# Altium schematic sheet Main_ASCII.SchDoc
size 152 x 127 mm; SheetNumber: 1
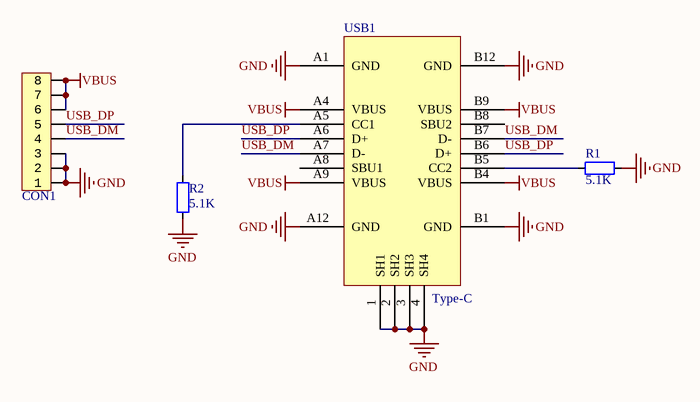
[diagram p0: Main_ASCII.SchDoc]

## Parts
CON1  FFC_0.5_8  [FFC_0.5_8]  (value not drawn)
R1  5.1K  [RES_0402]
R2  5.1K  [RES_0402]
USB1  Type-C  [Type-C-TOP]

## Nets
GND: CON1.1 CON1.2 CON1.3 R1.1 R2.2 USB1.1(SH1) USB1.2(SH2) USB1.3(SH3) USB1.4(SH4) USB1.A1(GND) USB1.A12(GND) USB1.B1(GND) USB1.B12(GND)
VBUS: CON1.6 CON1.7 CON1.8 USB1.A4(VBUS) USB1.A9(VBUS) USB1.B4(VBUS) USB1.B9(VBUS)
USB_DM: CON1.4 USB1.A7(D-) USB1.B7(D-)
USB_DP: CON1.5 USB1.A6(D+) USB1.B6(D+)
NetR1_2: R1.2 USB1.B5(CC2)
NetR2_1: R2.1 USB1.A5(CC1)

Not connected (* = marked no-connect by the designer): USB1 A8(SBU1) B8(SBU2)

## Library data of the parts
CON1 = FFC_0.5_8: FFC
R1 R2 = 电阻-0402: Resistor; Value: 22R
USB1 = USB-Type-C-TOP